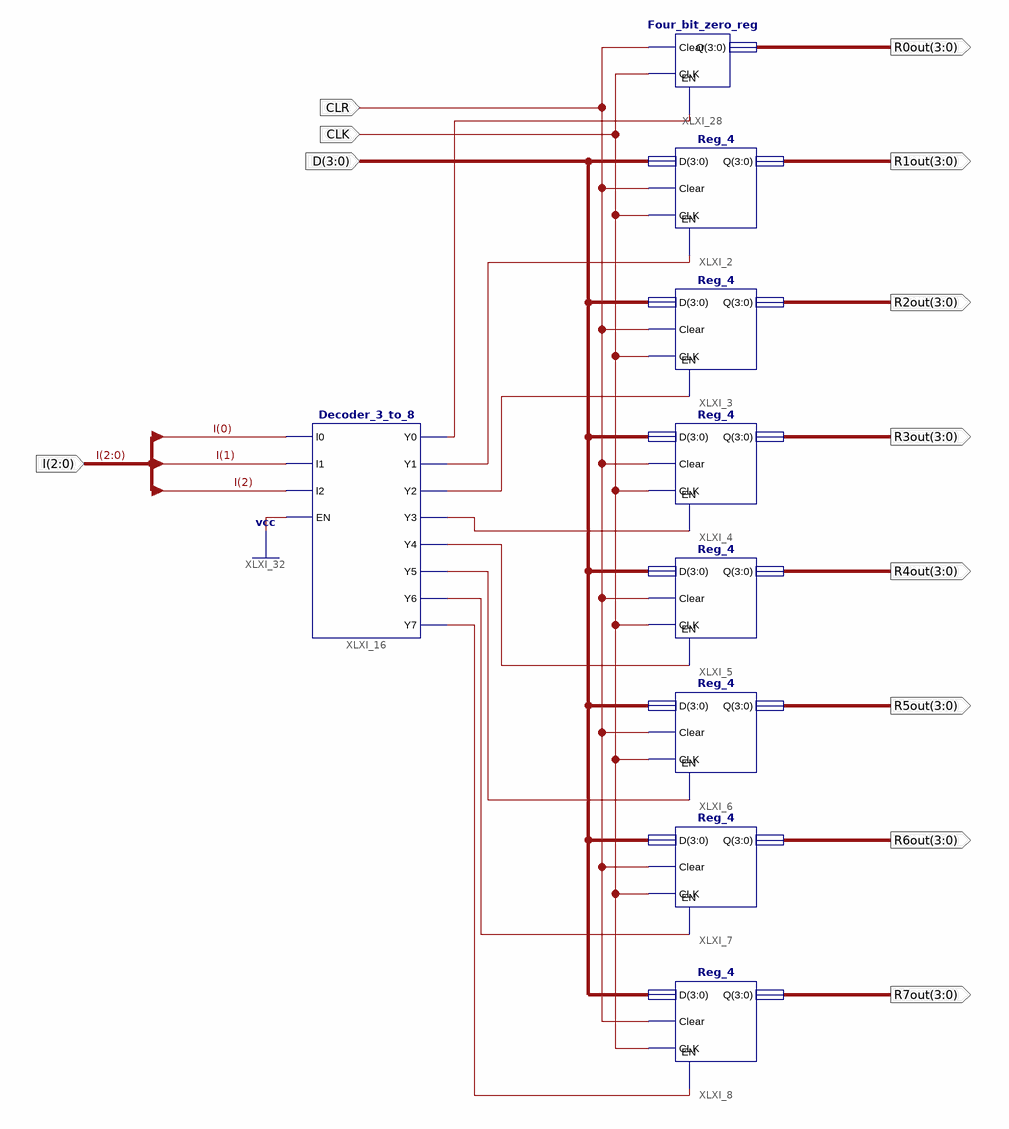
[diagram p0: schematic sheet 1]
// Xilinx ISE schematic Reg_bank.sch (spartan3e) as structural Verilog: 9 symbols, 12 ports
module Reg_bank (
  input  [3:0] D,
  input  CLR,
  input  CLK,
  input  [2:0] I,
  output [3:0] R0out,
  output [3:0] R1out,
  output [3:0] R2out,
  output [3:0] R3out,
  output [3:0] R4out,
  output [3:0] R5out,
  output [3:0] R6out,
  output [3:0] R7out
);

  wire XLXN_1, XLXN_2, XLXN_4, XLXN_5, XLXN_6, XLXN_12, XLXN_13, XLXN_14;

  Reg_4 XLXI_8 (.D(D), .Clear(CLR), .EN(XLXN_14), .CLK(CLK), .Q(R7out));
  Reg_4 XLXI_2 (.D(D), .Clear(CLR), .EN(XLXN_2), .CLK(CLK), .Q(R1out));
  Reg_4 XLXI_3 (.D(D), .Clear(CLR), .EN(XLXN_4), .CLK(CLK), .Q(R2out));
  Reg_4 XLXI_4 (.D(D), .Clear(CLR), .EN(XLXN_5), .CLK(CLK), .Q(R3out));
  Reg_4 XLXI_5 (.D(D), .Clear(CLR), .EN(XLXN_6), .CLK(CLK), .Q(R4out));
  Reg_4 XLXI_6 (.D(D), .Clear(CLR), .EN(XLXN_12), .CLK(CLK), .Q(R5out));
  Reg_4 XLXI_7 (.D(D), .Clear(CLR), .EN(XLXN_13), .CLK(CLK), .Q(R6out));
  Decoder_3_to_8 XLXI_16 (
    .EN(1'b1), .l0(I[0]), .l1(I[1]), .l2(I[2]), .Y0(XLXN_1), .Y1(XLXN_2), .Y2(XLXN_4), .Y3(XLXN_5),
    .Y4(XLXN_6), .Y5(XLXN_12), .Y6(XLXN_13), .Y7(XLXN_14));
  Four_bit_zero_reg XLXI_28 (.Clear(CLR), .EN(XLXN_1), .CLK(CLK), .Q(R0out));
endmodule
